# Altium project current amplifier.PrjPCB
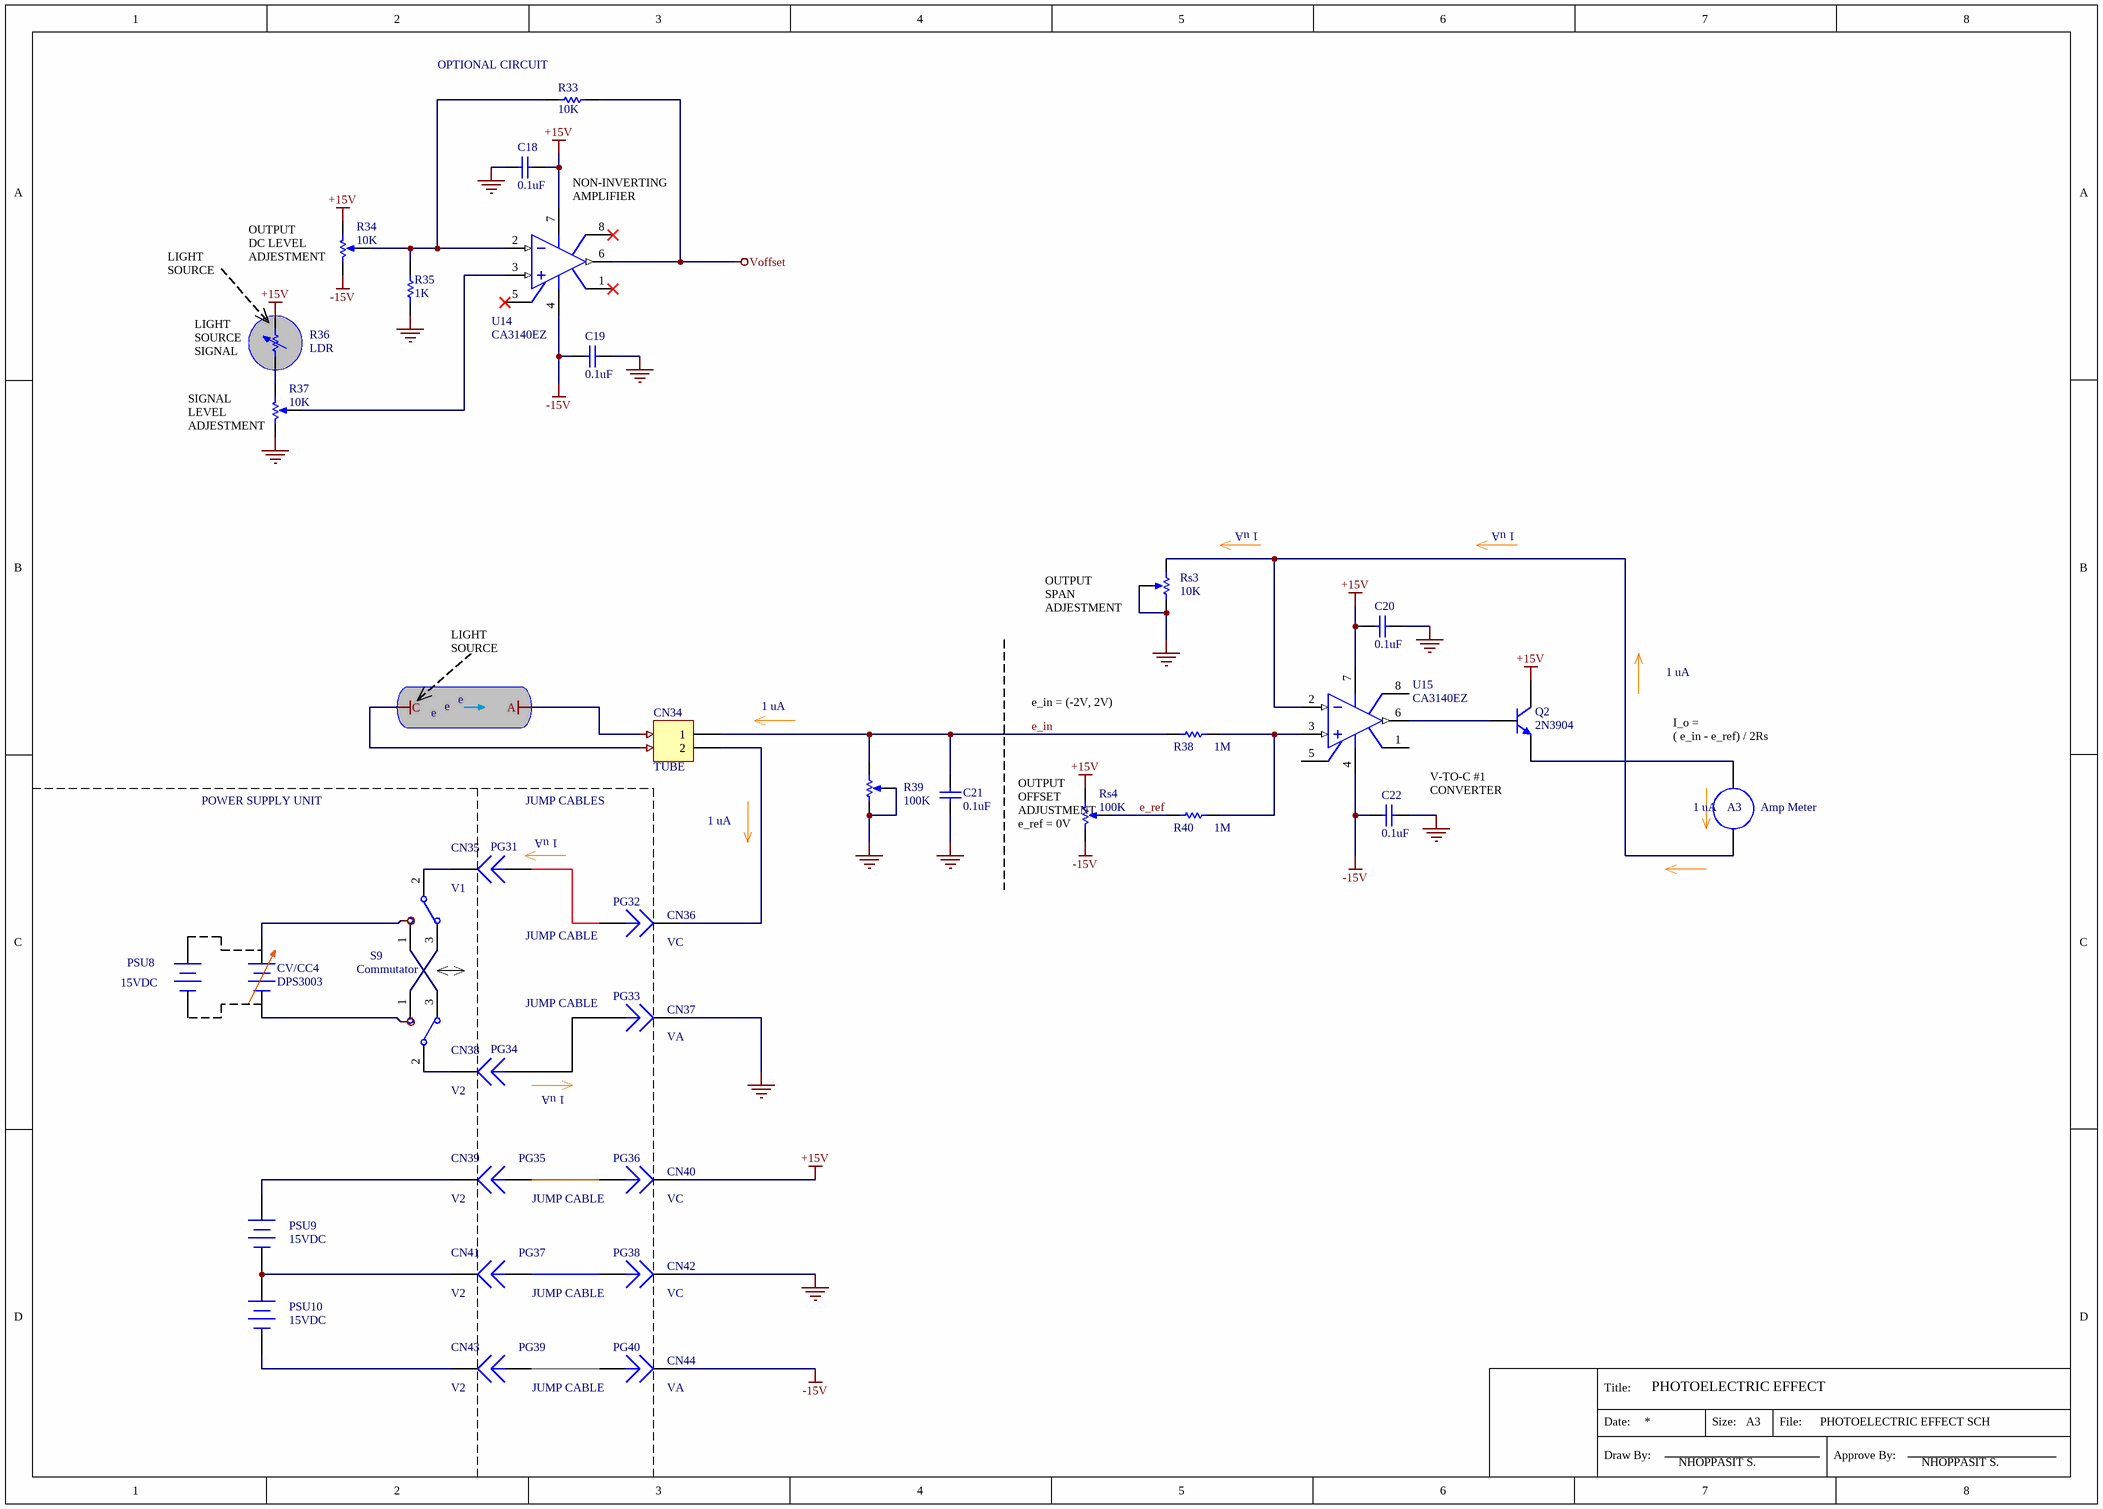
[diagram p0: current amplifier 06.SchDoc]
4 sheets, 211 parts. Net scope: global (net labels, ports and power ports of the same name join across sheets).
Sheets:
  current amplifier 06.SchDoc
  current amplifier 04.SchDoc
  current amplifier 05.SchDoc
  current amplifier 07.SchDoc

## Sheet current amplifier 06.SchDoc: PHOTOELECTRIC EFFECT
size A3; ApprovedBy: NHOPPASIT S.; CheckedBy: NHOPPASIT S.; Author: NHOPPASIT S.; DrawnBy: NHOPPASIT S.; DocumentNumber: EE-01; Revision: 1; SheetNumber: 1; SheetTotal: 1; Size: A3; PageSetup: Record=PageOptions|CenterHorizontal=True|CenterVertical=True|PrintScale=0.73|XCorrection=1.00|YCorrection=1.00|PrintKind=0|BorderSize=5000000|LeftOffset=0|BottomOffset=0|Orientation=2|PaperLength=1000|PaperWidth=1000|Scale=100|PaperSource=7|PrintQuality=-3|MediaType=1|DitherType=10|PrintScaleMode=1|PaperKind=A4|PaperIndex=9; DocumentName: PHOTOELECTRIC EFFECT SCH; ProjectName: PHOTOELECTRIC EFFECT 01

### Parts
(Parts that share a designator on the sheet are numbered #1, #2 ... from top to bottom, then left to right.)
A3  Amp Meter  [RAD-0.1]
C18  0.1uF  [RAD-0.3]
C19  0.1uF  [RAD-0.3]
C20  0.1uF  [RAD-0.3]
C21  0.1uF  [RAD-0.3]
C22  0.1uF  [RAD-0.3]
CN34  TUBE  [HDR1X2]
CN35  V1  [PIN1]
CN36  VC  [PIN1]
CN37  VA  [PIN1]
CN38  V2  [PIN1]
CN39  V2  [PIN1]
CN40  VC  [PIN1]
CN41  V2  [PIN1]
CN42  VC  [PIN1]
CN43  V2  [PIN1]
CN44  VA  [PIN1]
CV/CC4  DPS3003  [BAT-2]
PG31  Plug  [PIN1]  (value not drawn)
PG32  Plug  [PIN1]  (value not drawn)
PG33  Plug  [PIN1]  (value not drawn)
PG34  Plug  [PIN1]  (value not drawn)
PG35  Plug  [PIN1]  (value not drawn)
PG36  Plug  [PIN1]  (value not drawn)
PG37  Plug  [PIN1]  (value not drawn)
PG38  Plug  [PIN1]  (value not drawn)
PG39  Plug  [PIN1]  (value not drawn)
PG40  Plug  [PIN1]  (value not drawn)
PSU8  15VDC  [BAT-2]
PSU9  15VDC  [BAT-2]
PSU10  15VDC  [BAT-2]
Q2  2N3904  [TO-92A]
R33  10K  [AXIAL-0.3]
R34  10K  [VR5]
R35  1K  [AXIAL-0.3]
R36  LDR  [AXIAL-0.7]
R37  10K  [VR5]
R38  1M  [AXIAL-0.3]
R39  100K  [VR5]
R40  1M  [AXIAL-0.3]
Rs3#1  10K  [VR5]
Rs4  100K  [VR5]
S9  Commutator  [TL36WW15050]
S10  SW-SPDT  [TL36WW15050]  (value not drawn)
U14  CA3140EZ  [H-08A]
U15  CA3140EZ  [H-08A]

### Nets
+15V: C18.2 C20.1 CN40.1 Q2.3(C) R34.1(TOP) R36.2 Rs4.1(TOP) U14.7(V+) U15.7(V+)
-15V: C19.1 C22.1 CN44.1 R34.2(BOT) Rs4.2(BOT) U14.4(V-) U15.4(V-)
A: CV/CC4.1(+) CV/CC4.2(-)  [also labelled C, VCC]
GND: C18.1 C19.2 C20.2 C21.1 C22.2 CN37.1 CN42.1 R35.1 R37.2(BOT) R39.1(TOP) R39.3(TAP) Rs3#1.2(BOT) Rs3#1.3(TAP)
Voffset: R33.2 U14.6(OUT)
e_in: C21.2 CN34.1 R38.1 R39.2(BOT)
e_ref: R40.1 Rs4.3(TAP)
NetA3_1: A3.1 Rs3#1.1(TOP) U15.2(IN-)
NetA3_2: A3.2 Q2.1(E)
NetCN34_2: CN34.2 CN36.1
NetCN35_1: CN35.1 S9.2
NetCN38_1: CN38.1 S10.2
NetCN39_1: CN39.1 PSU9.1(+)
NetCN41_1: CN41.1 PSU9.2(-) PSU10.1(+)
NetCN43_1: CN43.1 PSU10.2(-)
NetPG31_1: PG31.1 PG32.1
NetPG33_1: PG33.1 PG34.1
NetPG35_1: PG35.1 PG36.1
NetPG37_1: PG37.1 PG38.1
NetPG39_1: PG39.1 PG40.1
NetQ2_2: Q2.2(B) U15.6(OUT)
NetR33_1: R33.1 R34.3(TAP) R35.2 U14.2(IN-)
NetR36_1: R36.1 R37.1(TOP)
NetR37_3: R37.3(TAP) U14.3(IN+)
NetR38_2: R38.2 R40.2 U15.3(IN+)
NetS9_1: S9.1 S10.3
NetS9_3: S9.3 S10.1

Not connected (* = marked no-connect by the designer): PSU8 1(+) 2(-); U14 1(OS_NUL)* 5(OS_NUL)* 8(TAB)*; U15 1(OS_NUL) 5(OS_NUL) 8(TAB)

### Notes on the sheet
- (near R33) OPTIONAL CIRCUIT
- NON-INVERTING
  AMPLIFIER
- LIGHT SOURCE
- (near R34) OUTPUT
  DC LEVEL
  ADJESTMENT
- (near R36) LIGHT SOURCE
  SIGNAL
- (near R37) SIGNAL
  LEVEL
  ADJESTMENT
- 1 uA
- (near Rs3#1) OUTPUT
  SPAN
  ADJESTMENT
- e
- e_in = (-2V, 2V)
- (near A3) I_o =
  ( e_in - e_ref) / 2Rs
- POWER SUPPLY UNIT
- JUMP CABLES
- (near PG31) 1 uA
- (near Rs4) OUTPUT
  OFFSET
  ADJUSTMENT
  e_ref = 0V
- V-TO-C #1
  CONVERTER
- (near A3) 1 uA
- JUMP CABLE
- (near PG34) 1 uA
- Title:
- Date:
- Draw By:
- Size:
- File:
- Approve By:

### Library data of the parts
A3 = Meter: Indicating Instrument; Note: Place a "letter" into the symbol to show the function of the meter or instrument; Published: 24-Mar-1999; LatestRevisionDate: 17-Jul-2002; LatestRevisionNote: Re-released for DXP Platform.; PackageReference: RAD-0.1; Publisher: Altium Limited; PackageDescription: Radial Cap, Thru-Hole; 2 Leads; 0.1 in Pin Spacing
C18-C22 = Cap: Capacitor; Published: 8-Jun-2000; LatestRevisionDate: 17-Jul-2002; LatestRevisionNote: Re-released for DXP Platform.; PackageReference: RAD-0.3; Publisher: Altium Limited; PackageDescription: Radial Cap, Thru-Hole; 2 Leads; 0.3 in Pin Spacing; Value: 0.1uF
CN34 = Header 2: Header, 2-Pin; LatestRevisionDate: 17-Jul-2002; LatestRevisionNote: Re-released for DXP Platform.; Publisher: Altium Limited
CN35-CN44 = Socket: LatestRevisionDate: 17-Jul-2002; LatestRevisionNote: Re-released for DXP Platform.; Publisher: Altium Limited
CV/CC4 PSU8-PSU10 = Battery: Multicell Battery; Published: 24-Mar-1999; LatestRevisionDate: 17-Jul-2002; LatestRevisionNote: Re-released for DXP Platform.; PackageReference: BAT-2; Publisher: Altium Limited; PackageDescription: Battery; 2 Leads
Q2 = 2N3904: NPN General Purpose Amplifier; Published: 8-Jun-2000; LatestRevisionDate: 15-Jan-2003; LatestRevisionNote: PCB Footprint 'BCY-W3/D4.7' replaced; DatasheetVersion: 1997; PackageVersion: Sep-1998; PackageReference: TO-92A; Publisher: Altium Limited; PackageDescription: TO, Flat Index; 3 In-Line, Axial Leads; Body Dia. 4.5mm; Leads 0.51 x 0.48 mm (max); ComponentLink1Description: Manufacturer Link; ComponentLink1URL: http://www.fairchildsemi.com/; ComponentLink2Description: Datasheet; ComponentLink2URL: http://www.fairchildsemi.com/ds/2N%2F2N3904.pdf
R33 R35 R38 R40 = Res1: Resistor; Published: 8-Jun-2000; LatestRevisionDate: 17-Jul-2002; LatestRevisionNote: Re-released for DXP Platform.; PackageReference: AXIAL-0.3; Publisher: Altium Limited; PackageDescription: Axial Device, Thru-Hole; 2 Leads; 0.3 in Pin Spacing
  R33: Value: 10K
  R35: Value: 1K
  R38 R40: Value: 1M
R34 R37 R39 Rs3#1 Rs4 = RPot: Potentiometer; Sim Note: Enter the Resistance value and the set point into parameter fields.; Set Position: 0.5; Published: 8-Jun-2000; LatestRevisionDate: 17-Jul-2002; LatestRevisionNote: Re-released for DXP Platform.; PackageReference: VR5; Publisher: Altium Limited; PackageDescription: Variable Resistor, Thru-Hole; 3 Leads
  R34 R37 Rs3#1: Value: 10K
  R39 Rs4: Value: 100K
R36 = Res Adj1: Variable Resistor; Value: 1K; Set Position: 0.5; Published: 8-Jun-2000; LatestRevisionDate: 17-Jul-2002; LatestRevisionNote: Re-released for DXP Platform.; PackageReference: AXIAL-0.7; Publisher: Altium Limited; PackageDescription: Axial Device, Thru-Hole; 2 Leads; 0.7 in Pin Spacing
S9 S10 = SW-SPDT: SPDT Subminiature Toggle Switch, Right Angle Mounting, Vertical Actuation; Published: 24-Mar-1999; LatestRevisionDate: 17-Dec-2003; LatestRevisionNote: Schematic revised, PCB Footprint replaced.; DatasheetVersion: 05-Dec-2000; PackageReference: TL36WW15050; Publisher: Altium Limited; PackageDescription: Switch; 4 Leads; ComponentLink1Description: Manufacturer Link; ComponentLink1URL: http://www.apem.com
U14 U15 = Op Amp: FET Operational Amplifier; Published: 8-Jun-2000; LatestRevisionDate: 17-Jul-2002; LatestRevisionNote: Re-released for DXP Platform.; DatasheetVersion: REV. B; PackageVersion: 1990; PackageReference: H-08A; Publisher: Altium Limited; PackageDescription: Can; 8 Leads; Pin Circle Dia. 5.08 mm; Lead Dia. 0.53 mm (max); ComponentLink1Description: Manufacturer Link; ComponentLink1URL: http://www.analog.com/
PG31-PG40 = Plug: LatestRevisionDate: 17-Jul-2002; LatestRevisionNote: Re-released for DXP Platform.; Publisher: Altium Limited

## Sheet current amplifier 04.SchDoc: PHOTOELECTRIC EFFECT
size A3; ApprovedBy: NHOPPASIT S.; CheckedBy: NHOPPASIT S.; Author: NHOPPASIT S.; DrawnBy: NHOPPASIT S.; DocumentNumber: EE-01; Revision: 1; SheetNumber: 1; SheetTotal: 1; Size: A3; PageSetup: Record=PageOptions|CenterHorizontal=True|CenterVertical=True|PrintScale=0.73|XCorrection=1.00|YCorrection=1.00|PrintKind=0|BorderSize=5000000|LeftOffset=0|BottomOffset=0|Orientation=2|PaperLength=1000|PaperWidth=1000|Scale=100|PaperSource=7|PrintQuality=-3|MediaType=1|DitherType=10|PrintScaleMode=1|PaperKind=A4|PaperIndex=9; DocumentName: PHOTOELECTRIC EFFECT SCH; ProjectName: PHOTOELECTRIC EFFECT 01
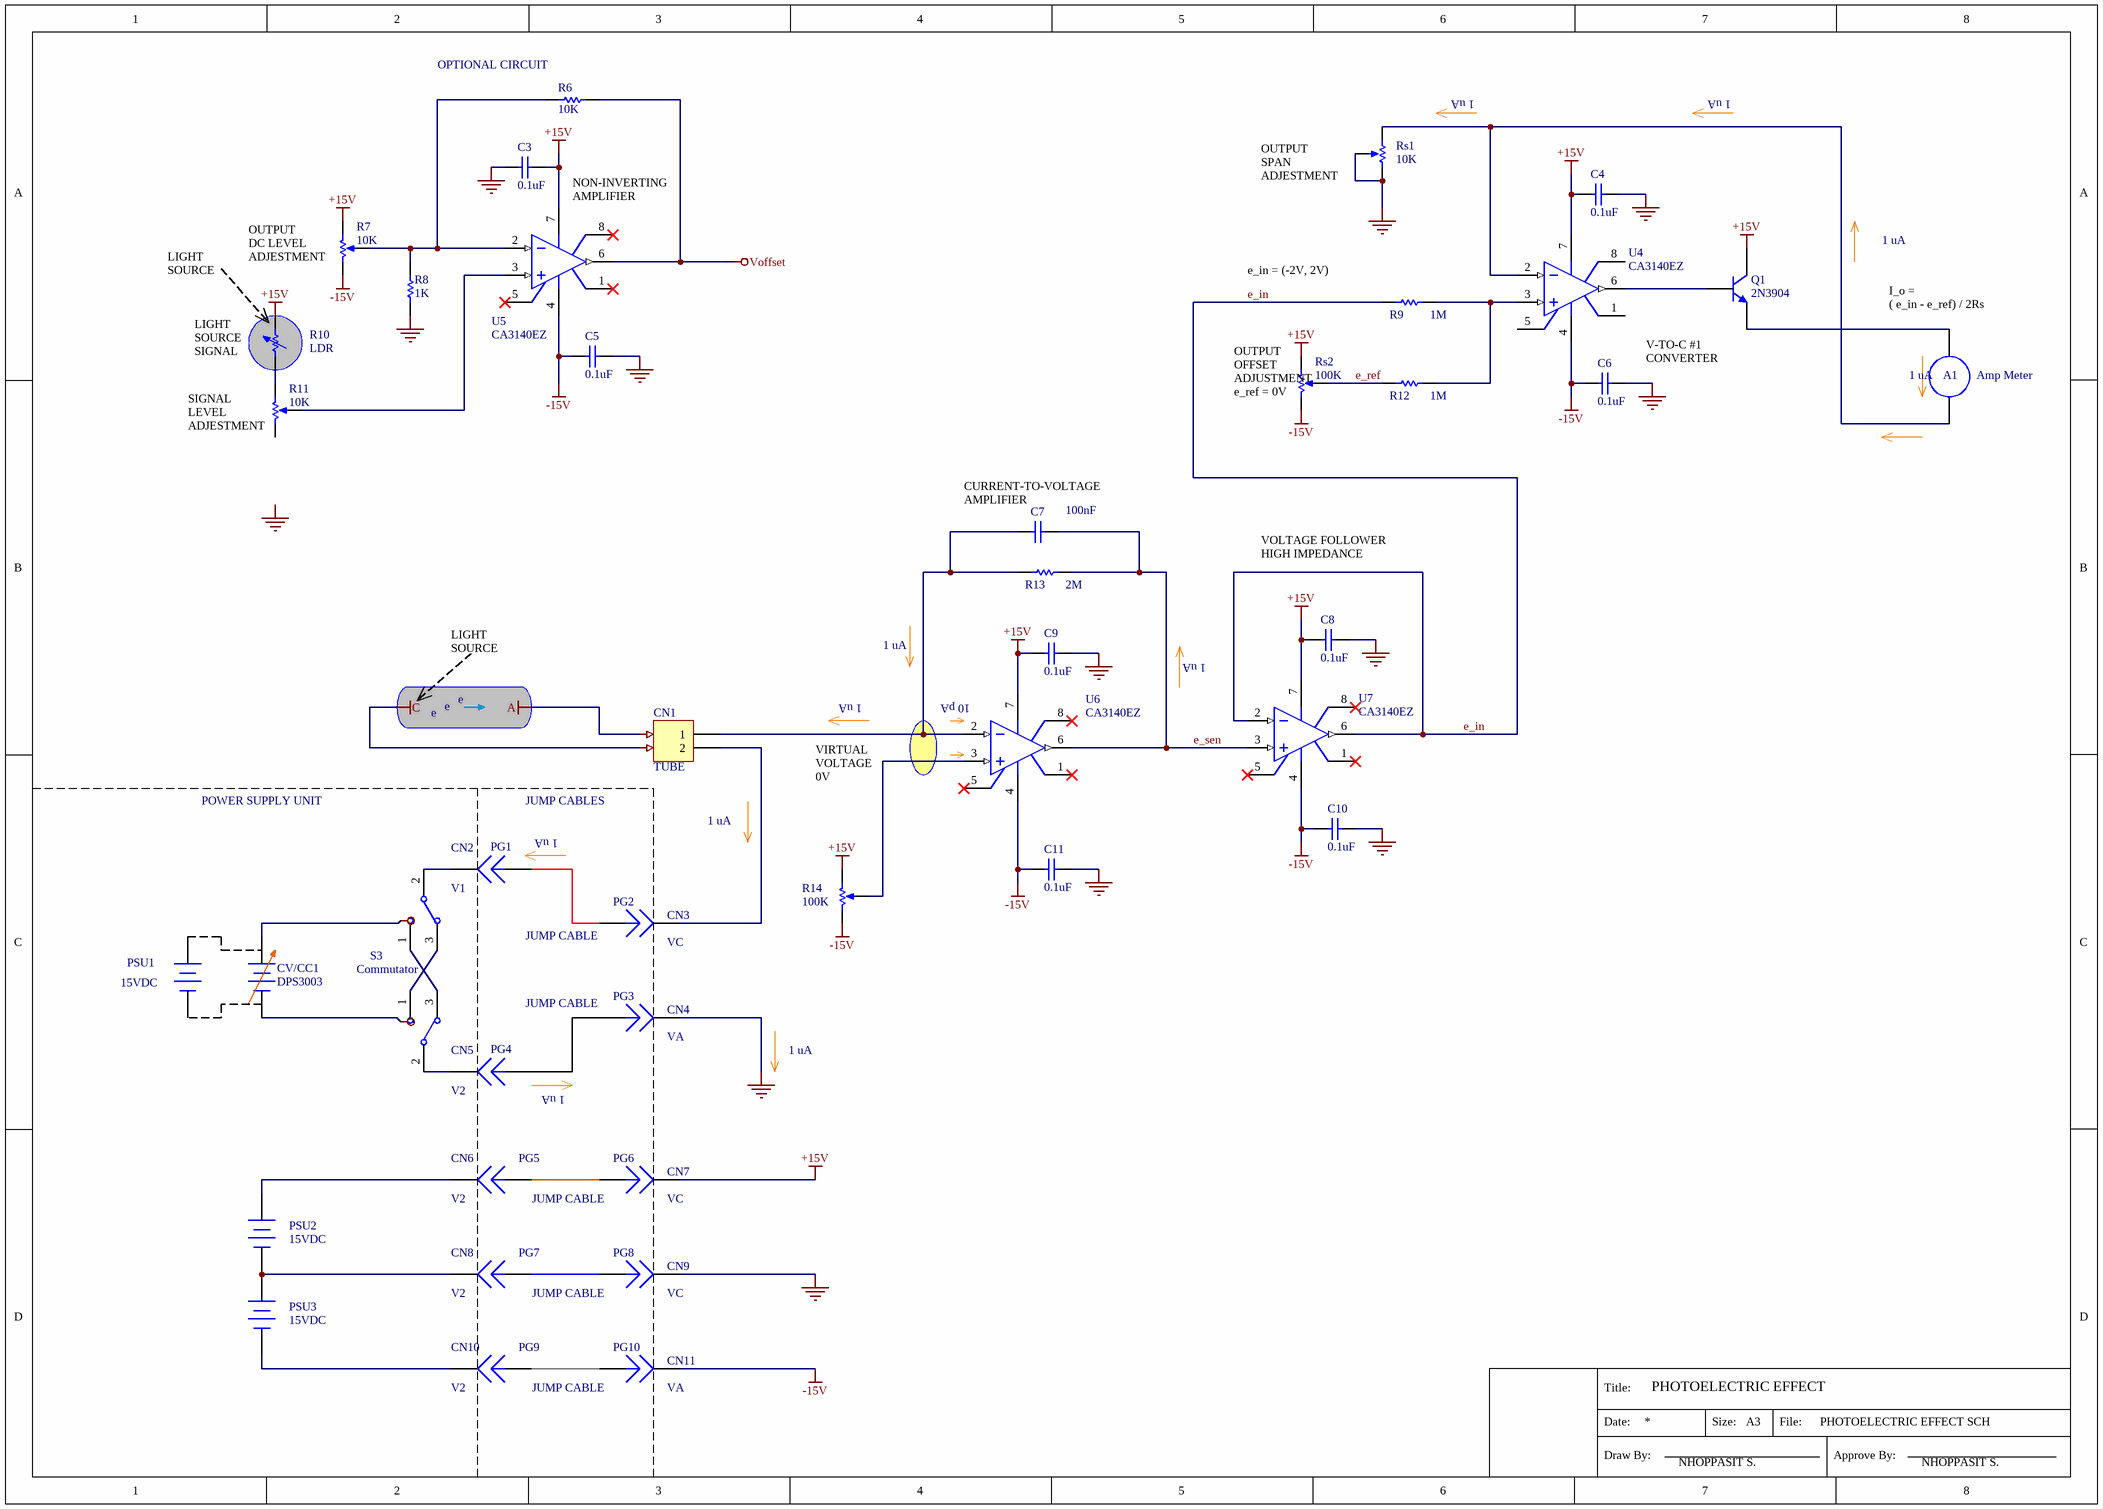
[diagram p1: current amplifier 04.SchDoc]

### Parts
(Parts that share a designator on the sheet are numbered #1, #2 ... from top to bottom, then left to right.)
A1#1  Amp Meter  [RAD-0.1]
C3#1  0.1uF  [RAD-0.3]
C4#1  0.1uF  [RAD-0.3]
C5#1  0.1uF  [RAD-0.3]
C6#1  0.1uF  [RAD-0.3]
C7#1  100nF  [RAD-0.3]
C8#1  0.1uF  [RAD-0.3]
C9#1  0.1uF  [RAD-0.3]
C10#1  0.1uF  [RAD-0.3]
C11#1  0.1uF  [RAD-0.3]
CN1#1  TUBE  [HDR1X2]
CN2#1  V1  [PIN1]
CN3#1  VC  [PIN1]
CN4#1  VA  [PIN1]
CN5#1  V2  [PIN1]
CN6#1  V2  [PIN1]
CN7#1  VC  [PIN1]
CN8#1  V2  [PIN1]
CN9#1  VC  [PIN1]
CN10#1  V2  [PIN1]
CN11#1  VA  [PIN1]
CV/CC1#1  DPS3003  [BAT-2]
PG1#1  Plug  [PIN1]  (value not drawn)
PG2#1  Plug  [PIN1]  (value not drawn)
PG3#1  Plug  [PIN1]  (value not drawn)
PG4#1  Plug  [PIN1]  (value not drawn)
PG5#1  Plug  [PIN1]  (value not drawn)
PG6#1  Plug  [PIN1]  (value not drawn)
PG7#1  Plug  [PIN1]  (value not drawn)
PG8#1  Plug  [PIN1]  (value not drawn)
PG9#1  Plug  [PIN1]  (value not drawn)
PG10#1  Plug  [PIN1]  (value not drawn)
PSU1#1  15VDC  [BAT-2]
PSU2#1  15VDC  [BAT-2]
PSU3#1  15VDC  [BAT-2]
Q1#1  2N3904  [TO-92A]
R6#1  10K  [AXIAL-0.3]
R7#1  10K  [VR5]
R8#1  1K  [AXIAL-0.3]
R9#1  1M  [AXIAL-0.3]
R10#1  LDR  [AXIAL-0.7]
R11#1  10K  [VR5]
R12#1  1M  [AXIAL-0.3]
R13#1  2M  [AXIAL-0.3]
R14#1  100K  [VR5]
Rs1#1  10K  [VR5]
Rs2#1  100K  [VR5]
S3#1  Commutator  [TL36WW15050]
S4#1  SW-SPDT  [TL36WW15050]  (value not drawn)
U4#1  CA3140EZ  [H-08A]
U5#1  CA3140EZ  [H-08A]
U6#1  CA3140EZ  [H-08A]
U7#1  CA3140EZ  [H-08A]

### Nets
+15V: C3#1.2 C4#1.1 C8#1.1 C9#1.1 CN7#1.1 Q1#1.3(C) R7#1.1(TOP) R10#1.2 R14#1.1(TOP) Rs2#1.1(TOP) U4#1.7(V+) U5#1.7(V+) U6#1.7(V+) U7#1.7(V+)
-15V: C5#1.1 C6#1.1 C10#1.1 C11#1.1 CN11#1.1 R7#1.2(BOT) R14#1.2(BOT) Rs2#1.2(BOT) U4#1.4(V-) U5#1.4(V-) U6#1.4(V-) U7#1.4(V-)
A: CV/CC1#1.1(+) CV/CC1#1.2(-)  [also labelled C, VCC]
GND: C3#1.1 C4#1.2 C5#1.2 C6#1.2 C8#1.2 C9#1.2 C10#1.2 C11#1.2 CN4#1.1 CN9#1.1 R8#1.1 Rs1#1.2(BOT) Rs1#1.3(TAP)
Voffset: R6#1.2 U5#1.6(OUT)
e_in: R9#1.1 U7#1.2(IN-) U7#1.6(OUT)
e_ref: R12#1.1 Rs2#1.3(TAP)
e_sen: C7#1.2 R13#1.2 U6#1.6(OUT) U7#1.3(IN+)
NetA1#1_1: A1#1.1 Rs1#1.1(TOP) U4#1.2(IN-)
NetA1#1_2: A1#1.2 Q1#1.1(E)
NetC7#1_1: C7#1.1 CN1#1.1 R13#1.1 U6#1.2(IN-)
NetCN1#1_2: CN1#1.2 CN3#1.1
NetCN2#1_1: CN2#1.1 S3#1.2
NetCN5#1_1: CN5#1.1 S4#1.2
NetCN6#1_1: CN6#1.1 PSU2#1.1(+)
NetCN8#1_1: CN8#1.1 PSU2#1.2(-) PSU3#1.1(+)
NetCN10#1_1: CN10#1.1 PSU3#1.2(-)
NetPG1#1_1: PG1#1.1 PG2#1.1
NetPG3#1_1: PG3#1.1 PG4#1.1
NetPG5#1_1: PG5#1.1 PG6#1.1
NetPG7#1_1: PG7#1.1 PG8#1.1
NetPG9#1_1: PG9#1.1 PG10#1.1
NetQ1#1_2: Q1#1.2(B) U4#1.6(OUT)
NetR6#1_1: R6#1.1 R7#1.3(TAP) R8#1.2 U5#1.2(IN-)
NetR9#1_2: R9#1.2 R12#1.2 U4#1.3(IN+)
NetR10#1_1: R10#1.1 R11#1.1(TOP)
NetR11#1_3: R11#1.3(TAP) U5#1.3(IN+)
NetR14#1_3: R14#1.3(TAP) U6#1.3(IN+)
NetS3#1_1: S3#1.1 S4#1.3
NetS3#1_3: S3#1.3 S4#1.1

Not connected (* = marked no-connect by the designer): PSU1#1 1(+) 2(-); R11#1 2(BOT); U4#1 1(OS_NUL) 5(OS_NUL) 8(TAB); U5#1 1(OS_NUL)* 5(OS_NUL)* 8(TAB)*; U6#1 1(OS_NUL)* 5(OS_NUL)* 8(TAB)*; U7#1 1(OS_NUL)* 5(OS_NUL)* 8(TAB)*

### Notes on the sheet
- (near R6#1) OPTIONAL CIRCUIT
- 1 uA
- (near Rs1#1) OUTPUT
  SPAN
  ADJESTMENT
- NON-INVERTING
  AMPLIFIER
- LIGHT SOURCE
- (near R7#1) OUTPUT
  DC LEVEL
  ADJESTMENT
- e_in = (-2V, 2V)
- (near A1#1) I_o =
  ( e_in - e_ref) / 2Rs
- (near R10#1) LIGHT SOURCE
  SIGNAL
- V-TO-C #1
  CONVERTER
- (near A1#1) 1 uA
- (near R11#1) SIGNAL
  LEVEL
  ADJESTMENT
- (near Rs2#1) OUTPUT
  OFFSET
  ADJUSTMENT
  e_ref = 0V
- (near C7#1) CURRENT-TO-VOLTAGE
  AMPLIFIER
- VOLTAGE FOLLOWER
  HIGH IMPEDANCE
- e
- (near U6#1) 10 pA
- VIRTUAL
  VOLTAGE
  0V
- POWER SUPPLY UNIT
- JUMP CABLES
- (near PG1#1) 1 uA
- JUMP CABLE
- (near PG4#1) 1 uA
- Labels drawn without touching a wire or pin: GND
- Title:
- Date:
- Draw By:
- Size:
- File:
- Approve By:

### Library data of the parts
A1#1 = Meter: as A3 on sheet current amplifier 06; Published: 24-Mar-1999; LatestRevisionDate: 17-Jul-2002; LatestRevisionNote: Re-released for DXP Platform.; PackageReference: RAD-0.1; Publisher: Altium Limited; PackageDescription: Radial Cap, Thru-Hole; 2 Leads; 0.1 in Pin Spacing
C3#1 C4#1 C5#1 C6#1 C7#1 C8#1 C9#1 C10#1 C11#1 = Cap: Capacitor; Published: 8-Jun-2000; LatestRevisionDate: 17-Jul-2002; LatestRevisionNote: Re-released for DXP Platform.; PackageReference: RAD-0.3; Publisher: Altium Limited; PackageDescription: Radial Cap, Thru-Hole; 2 Leads; 0.3 in Pin Spacing
  C3#1 C4#1 C5#1 C6#1 C8#1 C9#1 C10#1 C11#1: Value: 0.1uF
  C7#1: Value: 100nF
CN1#1 = Header 2: Header, 2-Pin; LatestRevisionDate: 17-Jul-2002; LatestRevisionNote: Re-released for DXP Platform.; Publisher: Altium Limited
CN2#1 CN3#1 CN4#1 CN5#1 CN6#1 CN7#1 CN8#1 CN9#1 CN10#1 CN11#1 = Socket: LatestRevisionDate: 17-Jul-2002; LatestRevisionNote: Re-released for DXP Platform.; Publisher: Altium Limited
CV/CC1#1 PSU1#1 PSU2#1 PSU3#1 = Battery: Multicell Battery; Published: 24-Mar-1999; LatestRevisionDate: 17-Jul-2002; LatestRevisionNote: Re-released for DXP Platform.; PackageReference: BAT-2; Publisher: Altium Limited; PackageDescription: Battery; 2 Leads
Q1#1 = 2N3904: NPN General Purpose Amplifier; Published: 8-Jun-2000; LatestRevisionDate: 15-Jan-2003; LatestRevisionNote: PCB Footprint 'BCY-W3/D4.7' replaced; DatasheetVersion: 1997; PackageVersion: Sep-1998; PackageReference: TO-92A; Publisher: Altium Limited; PackageDescription: TO, Flat Index; 3 In-Line, Axial Leads; Body Dia. 4.5mm; Leads 0.51 x 0.48 mm (max); ComponentLink1Description: Manufacturer Link; ComponentLink1URL: http://www.fairchildsemi.com/; ComponentLink2Description: Datasheet; ComponentLink2URL: http://www.fairchildsemi.com/ds/2N%2F2N3904.pdf
R6#1 R8#1 R9#1 R12#1 R13#1 = Res1: Resistor; Published: 8-Jun-2000; LatestRevisionDate: 17-Jul-2002; LatestRevisionNote: Re-released for DXP Platform.; PackageReference: AXIAL-0.3; Publisher: Altium Limited; PackageDescription: Axial Device, Thru-Hole; 2 Leads; 0.3 in Pin Spacing
  R6#1: Value: 10K
  R8#1: Value: 1K
  R9#1 R12#1: Value: 1M
  R13#1: Value: 2M
R7#1 R11#1 R14#1 Rs1#1 Rs2#1 = RPot: as R34 on sheet current amplifier 06; Published: 8-Jun-2000; LatestRevisionDate: 17-Jul-2002; LatestRevisionNote: Re-released for DXP Platform.; PackageReference: VR5; Publisher: Altium Limited; PackageDescription: Variable Resistor, Thru-Hole; 3 Leads
  R7#1 R11#1 Rs1#1: Value: 10K
  R14#1 Rs2#1: Value: 100K
R10#1 = Res Adj1: as R36 on sheet current amplifier 06; Published: 8-Jun-2000; LatestRevisionDate: 17-Jul-2002; LatestRevisionNote: Re-released for DXP Platform.; PackageReference: AXIAL-0.7; Publisher: Altium Limited; PackageDescription: Axial Device, Thru-Hole; 2 Leads; 0.7 in Pin Spacing
S3#1 S4#1 = SW-SPDT: as S9 on sheet current amplifier 06; Published: 24-Mar-1999; LatestRevisionDate: 17-Dec-2003; LatestRevisionNote: Schematic revised, PCB Footprint replaced.; DatasheetVersion: 05-Dec-2000; PackageReference: TL36WW15050; Publisher: Altium Limited; PackageDescription: Switch; 4 Leads; ComponentLink1Description: Manufacturer Link; ComponentLink1URL: http://www.apem.com
U4#1 U5#1 U6#1 U7#1 = Op Amp: FET Operational Amplifier; Published: 8-Jun-2000; LatestRevisionDate: 17-Jul-2002; LatestRevisionNote: Re-released for DXP Platform.; DatasheetVersion: REV. B; PackageVersion: 1990; PackageReference: H-08A; Publisher: Altium Limited; PackageDescription: Can; 8 Leads; Pin Circle Dia. 5.08 mm; Lead Dia. 0.53 mm (max); ComponentLink1Description: Manufacturer Link; ComponentLink1URL: http://www.analog.com/
PG1#1 PG2#1 PG3#1 PG4#1 PG5#1 PG6#1 PG7#1 PG8#1 PG9#1 PG10#1 = Plug: LatestRevisionDate: 17-Jul-2002; LatestRevisionNote: Re-released for DXP Platform.; Publisher: Altium Limited

## Sheet current amplifier 05.SchDoc: PHOTOELECTRIC EFFECT
size A3; ApprovedBy: NHOPPASIT S.; CheckedBy: NHOPPASIT S.; Author: NHOPPASIT S.; DrawnBy: NHOPPASIT S.; DocumentNumber: EE-01; Revision: 1; SheetNumber: 1; SheetTotal: 1; Size: A3; PageSetup: Record=PageOptions|CenterHorizontal=True|CenterVertical=True|PrintScale=0.73|XCorrection=1.00|YCorrection=1.00|PrintKind=0|BorderSize=5000000|LeftOffset=0|BottomOffset=0|Orientation=2|PaperLength=1000|PaperWidth=1000|Scale=100|PaperSource=7|PrintQuality=-3|MediaType=1|DitherType=10|PrintScaleMode=1|PaperKind=A4|PaperIndex=9; DocumentName: PHOTOELECTRIC EFFECT SCH; ProjectName: PHOTOELECTRIC EFFECT 01
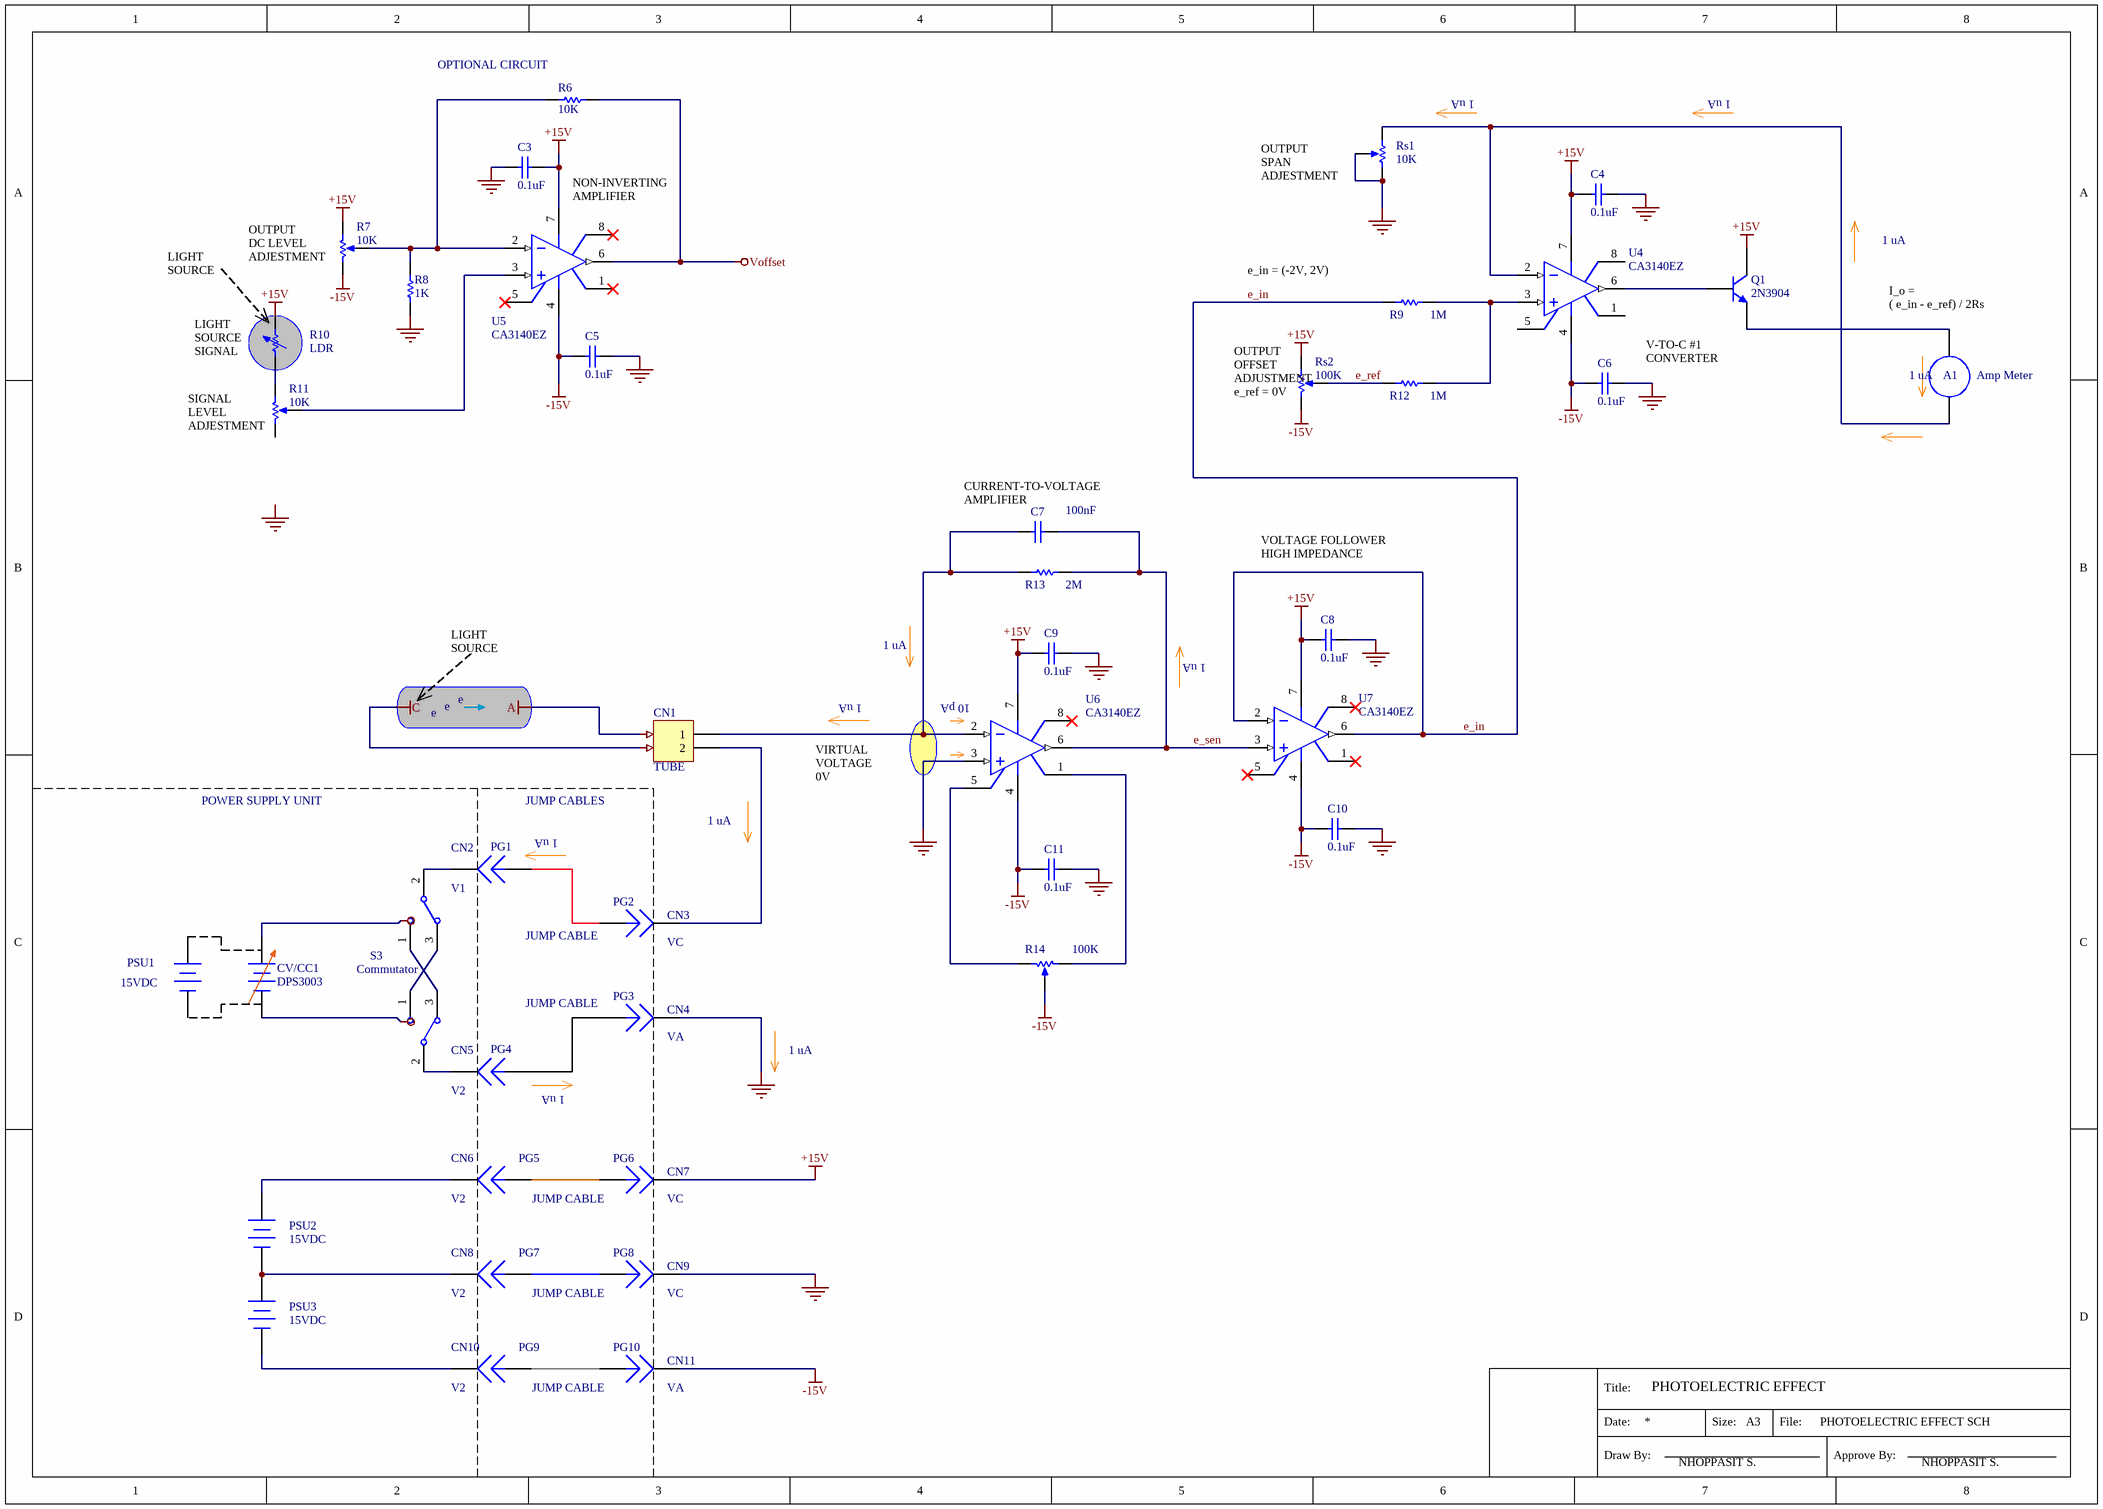
[diagram p2: current amplifier 05.SchDoc]

### Parts
(Parts that share a designator on the sheet are numbered #1, #2 ... from top to bottom, then left to right.)
A1#2  Amp Meter  [RAD-0.1]
C3#2  0.1uF  [RAD-0.3]
C4#2  0.1uF  [RAD-0.3]
C5#2  0.1uF  [RAD-0.3]
C6#2  0.1uF  [RAD-0.3]
C7#2  100nF  [RAD-0.3]
C8#2  0.1uF  [RAD-0.3]
C9#2  0.1uF  [RAD-0.3]
C10#2  0.1uF  [RAD-0.3]
C11#2  0.1uF  [RAD-0.3]
CN1#2  TUBE  [HDR1X2]
CN2#2  V1  [PIN1]
CN3#2  VC  [PIN1]
CN4#2  VA  [PIN1]
CN5#2  V2  [PIN1]
CN6#2  V2  [PIN1]
CN7#2  VC  [PIN1]
CN8#2  V2  [PIN1]
CN9#2  VC  [PIN1]
CN10#2  V2  [PIN1]
CN11#2  VA  [PIN1]
CV/CC1#2  DPS3003  [BAT-2]
PG1#2  Plug  [PIN1]  (value not drawn)
PG2#2  Plug  [PIN1]  (value not drawn)
PG3#2  Plug  [PIN1]  (value not drawn)
PG4#2  Plug  [PIN1]  (value not drawn)
PG5#2  Plug  [PIN1]  (value not drawn)
PG6#2  Plug  [PIN1]  (value not drawn)
PG7#2  Plug  [PIN1]  (value not drawn)
PG8#2  Plug  [PIN1]  (value not drawn)
PG9#2  Plug  [PIN1]  (value not drawn)
PG10#2  Plug  [PIN1]  (value not drawn)
PSU1#2  15VDC  [BAT-2]
PSU2#2  15VDC  [BAT-2]
PSU3#2  15VDC  [BAT-2]
Q1#2  2N3904  [TO-92A]
R6#2  10K  [AXIAL-0.3]
R7#2  10K  [VR5]
R8#2  1K  [AXIAL-0.3]
R9#2  1M  [AXIAL-0.3]
R10#2  LDR  [AXIAL-0.7]
R11#2  10K  [VR5]
R12#2  1M  [AXIAL-0.3]
R13#2  2M  [AXIAL-0.3]
R14#2  100K  [VR5]
Rs1#2  10K  [VR5]
Rs2#2  100K  [VR5]
S3#2  Commutator  [TL36WW15050]
S4#2  SW-SPDT  [TL36WW15050]  (value not drawn)
U4#2  CA3140EZ  [H-08A]
U5#2  CA3140EZ  [H-08A]
U6#2  CA3140EZ  [H-08A]
U7#2  CA3140EZ  [H-08A]

### Nets
+15V: C3#2.2 C4#2.1 C8#2.1 C9#2.1 CN7#2.1 Q1#2.3(C) R7#2.1(TOP) R10#2.2 Rs2#2.1(TOP) U4#2.7(V+) U5#2.7(V+) U6#2.7(V+) U7#2.7(V+)
-15V: C5#2.1 C6#2.1 C10#2.1 C11#2.1 CN11#2.1 R7#2.2(BOT) R14#2.3(TAP) Rs2#2.2(BOT) U4#2.4(V-) U5#2.4(V-) U6#2.4(V-) U7#2.4(V-)
A: CV/CC1#2.1(+) CV/CC1#2.2(-)  [also labelled C, VCC]
GND: C3#2.1 C4#2.2 C5#2.2 C6#2.2 C8#2.2 C9#2.2 C10#2.2 C11#2.2 CN4#2.1 CN9#2.1 R8#2.1 Rs1#2.2(BOT) Rs1#2.3(TAP) U6#2.3(IN+)
Voffset: R6#2.2 U5#2.6(OUT)
e_in: R9#2.1 U7#2.2(IN-) U7#2.6(OUT)
e_ref: R12#2.1 Rs2#2.3(TAP)
e_sen: C7#2.2 R13#2.2 U6#2.6(OUT) U7#2.3(IN+)
NetA1#2_1: A1#2.1 Rs1#2.1(TOP) U4#2.2(IN-)
NetA1#2_2: A1#2.2 Q1#2.1(E)
NetC7#2_1: C7#2.1 CN1#2.1 R13#2.1 U6#2.2(IN-)
NetCN1#2_2: CN1#2.2 CN3#2.1
NetCN2#2_1: CN2#2.1 S3#2.2
NetCN5#2_1: CN5#2.1 S4#2.2
NetCN6#2_1: CN6#2.1 PSU2#2.1(+)
NetCN8#2_1: CN8#2.1 PSU2#2.2(-) PSU3#2.1(+)
NetCN10#2_1: CN10#2.1 PSU3#2.2(-)
NetPG1#2_1: PG1#2.1 PG2#2.1
NetPG3#2_1: PG3#2.1 PG4#2.1
NetPG5#2_1: PG5#2.1 PG6#2.1
NetPG7#2_1: PG7#2.1 PG8#2.1
NetPG9#2_1: PG9#2.1 PG10#2.1
NetQ1#2_2: Q1#2.2(B) U4#2.6(OUT)
NetR6#2_1: R6#2.1 R7#2.3(TAP) R8#2.2 U5#2.2(IN-)
NetR9#2_2: R9#2.2 R12#2.2 U4#2.3(IN+)
NetR10#2_1: R10#2.1 R11#2.1(TOP)
NetR11#2_3: R11#2.3(TAP) U5#2.3(IN+)
NetR14#2_1: R14#2.1(TOP) U6#2.1(OS_NUL)
NetR14#2_2: R14#2.2(BOT) U6#2.5(OS_NUL)
NetS3#2_1: S3#2.1 S4#2.3
NetS3#2_3: S3#2.3 S4#2.1

Not connected (* = marked no-connect by the designer): PSU1#2 1(+) 2(-); R11#2 2(BOT); U4#2 1(OS_NUL) 5(OS_NUL) 8(TAB); U5#2 1(OS_NUL)* 5(OS_NUL)* 8(TAB)*; U6#2 8(TAB)*; U7#2 1(OS_NUL)* 5(OS_NUL)* 8(TAB)*

### Notes on the sheet
- (near R6#2) OPTIONAL CIRCUIT
- 1 uA
- (near Rs1#2) OUTPUT
  SPAN
  ADJESTMENT
- NON-INVERTING
  AMPLIFIER
- LIGHT SOURCE
- (near R7#2) OUTPUT
  DC LEVEL
  ADJESTMENT
- e_in = (-2V, 2V)
- (near A1#2) I_o =
  ( e_in - e_ref) / 2Rs
- (near R10#2) LIGHT SOURCE
  SIGNAL
- V-TO-C #1
  CONVERTER
- (near A1#2) 1 uA
- (near R11#2) SIGNAL
  LEVEL
  ADJESTMENT
- (near Rs2#2) OUTPUT
  OFFSET
  ADJUSTMENT
  e_ref = 0V
- (near C7#2) CURRENT-TO-VOLTAGE
  AMPLIFIER
- VOLTAGE FOLLOWER
  HIGH IMPEDANCE
- e
- (near U6#2) 10 pA
- VIRTUAL
  VOLTAGE
  0V
- POWER SUPPLY UNIT
- JUMP CABLES
- (near PG1#2) 1 uA
- JUMP CABLE
- (near PG4#2) 1 uA
- Labels drawn without touching a wire or pin: GND
- Title:
- Date:
- Draw By:
- Size:
- File:
- Approve By:

### Library data of the parts
A1#2 = Meter: as A3 on sheet current amplifier 06; Published: 24-Mar-1999; LatestRevisionDate: 17-Jul-2002; LatestRevisionNote: Re-released for DXP Platform.; PackageReference: RAD-0.1; Publisher: Altium Limited; PackageDescription: Radial Cap, Thru-Hole; 2 Leads; 0.1 in Pin Spacing
C3#2 C4#2 C5#2 C6#2 C7#2 C8#2 C9#2 C10#2 C11#2 = Cap: Capacitor; Published: 8-Jun-2000; LatestRevisionDate: 17-Jul-2002; LatestRevisionNote: Re-released for DXP Platform.; PackageReference: RAD-0.3; Publisher: Altium Limited; PackageDescription: Radial Cap, Thru-Hole; 2 Leads; 0.3 in Pin Spacing
  C3#2 C4#2 C5#2 C6#2 C8#2 C9#2 C10#2 C11#2: Value: 0.1uF
  C7#2: Value: 100nF
CN1#2 = Header 2: Header, 2-Pin; LatestRevisionDate: 17-Jul-2002; LatestRevisionNote: Re-released for DXP Platform.; Publisher: Altium Limited
CN2#2 CN3#2 CN4#2 CN5#2 CN6#2 CN7#2 CN8#2 CN9#2 CN10#2 CN11#2 = Socket: LatestRevisionDate: 17-Jul-2002; LatestRevisionNote: Re-released for DXP Platform.; Publisher: Altium Limited
CV/CC1#2 PSU1#2 PSU2#2 PSU3#2 = Battery: Multicell Battery; Published: 24-Mar-1999; LatestRevisionDate: 17-Jul-2002; LatestRevisionNote: Re-released for DXP Platform.; PackageReference: BAT-2; Publisher: Altium Limited; PackageDescription: Battery; 2 Leads
Q1#2 = 2N3904: NPN General Purpose Amplifier; Published: 8-Jun-2000; LatestRevisionDate: 15-Jan-2003; LatestRevisionNote: PCB Footprint 'BCY-W3/D4.7' replaced; DatasheetVersion: 1997; PackageVersion: Sep-1998; PackageReference: TO-92A; Publisher: Altium Limited; PackageDescription: TO, Flat Index; 3 In-Line, Axial Leads; Body Dia. 4.5mm; Leads 0.51 x 0.48 mm (max); ComponentLink1Description: Manufacturer Link; ComponentLink1URL: http://www.fairchildsemi.com/; ComponentLink2Description: Datasheet; ComponentLink2URL: http://www.fairchildsemi.com/ds/2N%2F2N3904.pdf
R6#2 R8#2 R9#2 R12#2 R13#2 = Res1: Resistor; Published: 8-Jun-2000; LatestRevisionDate: 17-Jul-2002; LatestRevisionNote: Re-released for DXP Platform.; PackageReference: AXIAL-0.3; Publisher: Altium Limited; PackageDescription: Axial Device, Thru-Hole; 2 Leads; 0.3 in Pin Spacing
  R6#2: Value: 10K
  R8#2: Value: 1K
  R9#2 R12#2: Value: 1M
  R13#2: Value: 2M
R7#2 R11#2 R14#2 Rs1#2 Rs2#2 = RPot: as R34 on sheet current amplifier 06; Published: 8-Jun-2000; LatestRevisionDate: 17-Jul-2002; LatestRevisionNote: Re-released for DXP Platform.; PackageReference: VR5; Publisher: Altium Limited; PackageDescription: Variable Resistor, Thru-Hole; 3 Leads
  R7#2 R11#2 Rs1#2: Value: 10K
  R14#2 Rs2#2: Value: 100K
R10#2 = Res Adj1: as R36 on sheet current amplifier 06; Published: 8-Jun-2000; LatestRevisionDate: 17-Jul-2002; LatestRevisionNote: Re-released for DXP Platform.; PackageReference: AXIAL-0.7; Publisher: Altium Limited; PackageDescription: Axial Device, Thru-Hole; 2 Leads; 0.7 in Pin Spacing
S3#2 S4#2 = SW-SPDT: as S9 on sheet current amplifier 06; Published: 24-Mar-1999; LatestRevisionDate: 17-Dec-2003; LatestRevisionNote: Schematic revised, PCB Footprint replaced.; DatasheetVersion: 05-Dec-2000; PackageReference: TL36WW15050; Publisher: Altium Limited; PackageDescription: Switch; 4 Leads; ComponentLink1Description: Manufacturer Link; ComponentLink1URL: http://www.apem.com
U4#2 U5#2 U6#2 U7#2 = Op Amp: FET Operational Amplifier; Published: 8-Jun-2000; LatestRevisionDate: 17-Jul-2002; LatestRevisionNote: Re-released for DXP Platform.; DatasheetVersion: REV. B; PackageVersion: 1990; PackageReference: H-08A; Publisher: Altium Limited; PackageDescription: Can; 8 Leads; Pin Circle Dia. 5.08 mm; Lead Dia. 0.53 mm (max); ComponentLink1Description: Manufacturer Link; ComponentLink1URL: http://www.analog.com/
PG1#2 PG2#2 PG3#2 PG4#2 PG5#2 PG6#2 PG7#2 PG8#2 PG9#2 PG10#2 = Plug: LatestRevisionDate: 17-Jul-2002; LatestRevisionNote: Re-released for DXP Platform.; Publisher: Altium Limited

## Sheet current amplifier 07.SchDoc: PHOTOELECTRIC EFFECT
size A3; ApprovedBy: NHOPPASIT S.; CheckedBy: NHOPPASIT S.; Author: NHOPPASIT S.; DrawnBy: NHOPPASIT S.; DocumentNumber: EE-01; Revision: 1; SheetNumber: 1; SheetTotal: 1; Size: A3; PageSetup: Record=PageOptions|CenterHorizontal=True|CenterVertical=True|PrintScale=0.73|XCorrection=1.00|YCorrection=1.00|PrintKind=0|BorderSize=5000000|LeftOffset=0|BottomOffset=0|Orientation=2|PaperLength=1000|PaperWidth=1000|Scale=100|PaperSource=7|PrintQuality=-3|MediaType=1|DitherType=10|PrintScaleMode=1|PaperKind=A4|PaperIndex=9; DocumentName: PHOTOELECTRIC EFFECT SCH; ProjectName: PHOTOELECTRIC EFFECT 01
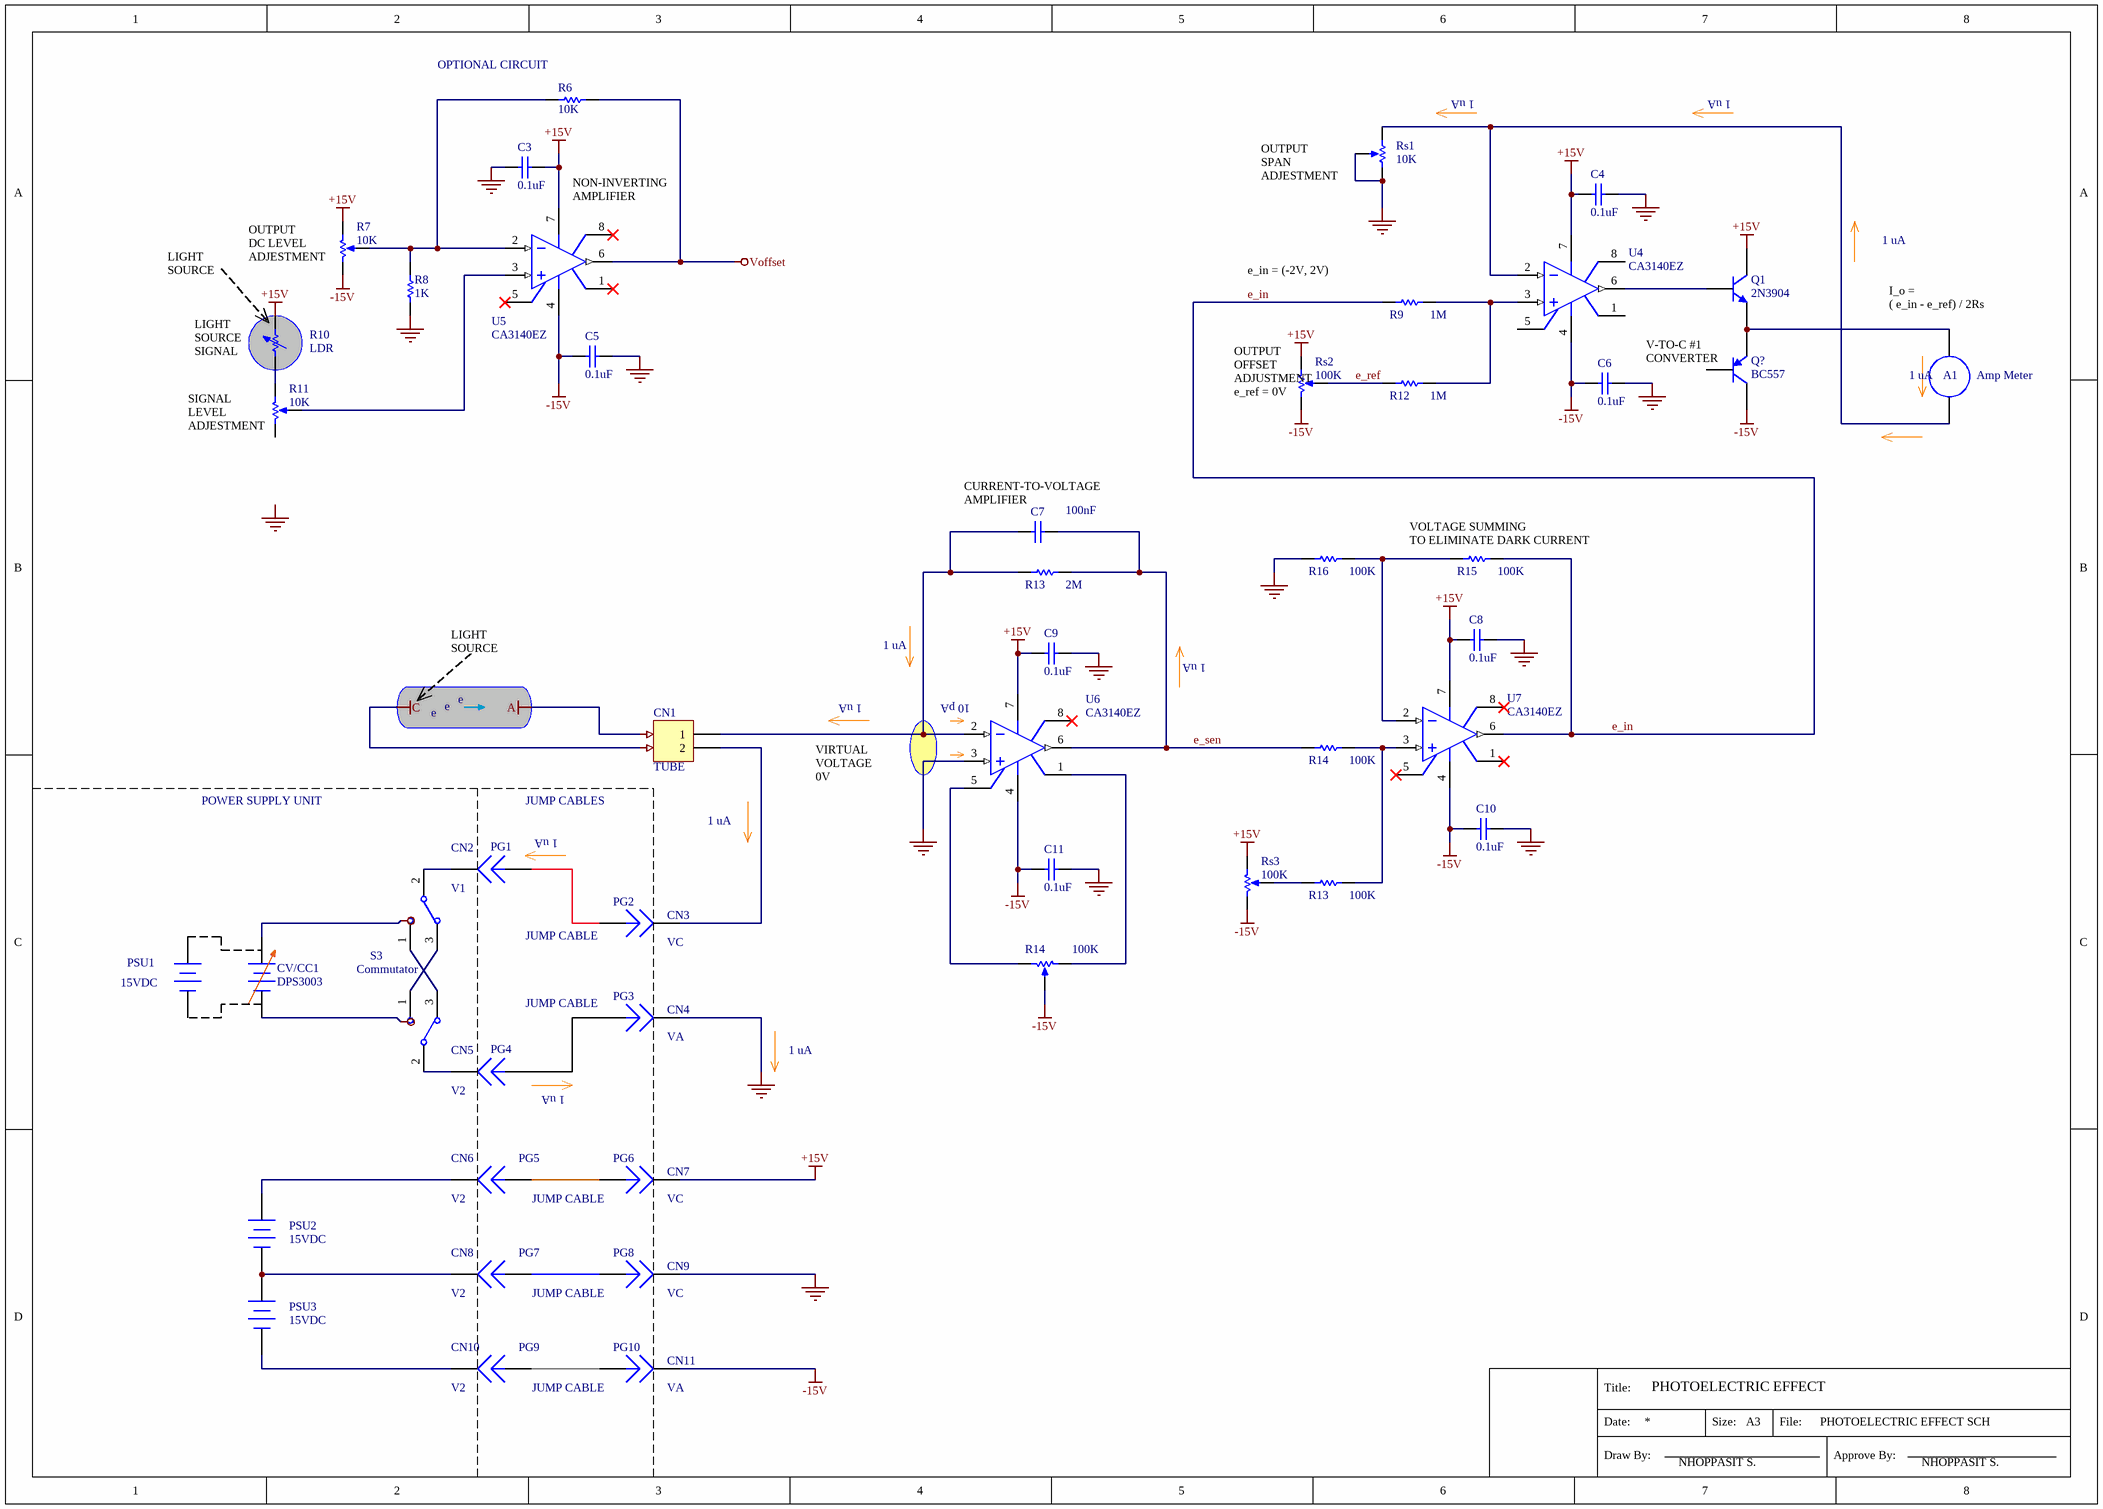
[diagram p3: current amplifier 07.SchDoc]

### Parts
(Parts that share a designator on the sheet are numbered #1, #2 ... from top to bottom, then left to right.)
A1#3  Amp Meter  [RAD-0.1]
C3#3  0.1uF  [RAD-0.3]
C4#3  0.1uF  [RAD-0.3]
C5#3  0.1uF  [RAD-0.3]
C6#3  0.1uF  [RAD-0.3]
C7#3  100nF  [RAD-0.3]
C8#3  0.1uF  [RAD-0.3]
C9#3  0.1uF  [RAD-0.3]
C10#3  0.1uF  [RAD-0.3]
C11#3  0.1uF  [RAD-0.3]
CN1#3  TUBE  [HDR1X2]
CN2#3  V1  [PIN1]
CN3#3  VC  [PIN1]
CN4#3  VA  [PIN1]
CN5#3  V2  [PIN1]
CN6#3  V2  [PIN1]
CN7#3  VC  [PIN1]
CN8#3  V2  [PIN1]
CN9#3  VC  [PIN1]
CN10#3  V2  [PIN1]
CN11#3  VA  [PIN1]
CV/CC1#3  DPS3003  [BAT-2]
PG1#3  Plug  [PIN1]  (value not drawn)
PG2#3  Plug  [PIN1]  (value not drawn)
PG3#3  Plug  [PIN1]  (value not drawn)
PG4#3  Plug  [PIN1]  (value not drawn)
PG5#3  Plug  [PIN1]  (value not drawn)
PG6#3  Plug  [PIN1]  (value not drawn)
PG7#3  Plug  [PIN1]  (value not drawn)
PG8#3  Plug  [PIN1]  (value not drawn)
PG9#3  Plug  [PIN1]  (value not drawn)
PG10#3  Plug  [PIN1]  (value not drawn)
PSU1#3  15VDC  [BAT-2]
PSU2#3  15VDC  [BAT-2]
PSU3#3  15VDC  [BAT-2]
Q1#3  2N3904  [TO-92A]
Q?  BC557  [29-04]
R6#3  10K  [AXIAL-0.3]
R7#3  10K  [VR5]
R8#3  1K  [AXIAL-0.3]
R9#3  1M  [AXIAL-0.3]
R10#3  LDR  [AXIAL-0.7]
R11#3  10K  [VR5]
R12#3  1M  [AXIAL-0.3]
R13#3  2M  [AXIAL-0.3]
R13#4  100K  [AXIAL-0.3]
R14#3  100K  [AXIAL-0.3]
R14#4  100K  [VR5]
R15  100K  [AXIAL-0.3]
R16  100K  [AXIAL-0.3]
Rs1#3  10K  [VR5]
Rs2#3  100K  [VR5]
Rs3#2  100K  [VR5]
S3#3  Commutator  [TL36WW15050]
S4#3  SW-SPDT  [TL36WW15050]  (value not drawn)
U4#3  CA3140EZ  [H-08A]
U5#3  CA3140EZ  [H-08A]
U6#3  CA3140EZ  [H-08A]
U7#3  CA3140EZ  [H-08A]

### Nets
+15V: C3#3.2 C4#3.1 C8#3.1 C9#3.1 CN7#3.1 Q1#3.3(C) R7#3.1(TOP) R10#3.2 Rs2#3.1(TOP) Rs3#2.1(TOP) U4#3.7(V+) U5#3.7(V+) U6#3.7(V+) U7#3.7(V+)
-15V: C5#3.1 C6#3.1 C10#3.1 C11#3.1 CN11#3.1 Q?.1(C) R7#3.2(BOT) R14#4.3(TAP) Rs2#3.2(BOT) Rs3#2.2(BOT) U4#3.4(V-) U5#3.4(V-) U6#3.4(V-) U7#3.4(V-)
A: CV/CC1#3.1(+) CV/CC1#3.2(-)  [also labelled C, VCC]
GND: C3#3.1 C4#3.2 C5#3.2 C6#3.2 C8#3.2 C9#3.2 C10#3.2 C11#3.2 CN4#3.1 CN9#3.1 R8#3.1 R16.1 Rs1#3.2(BOT) Rs1#3.3(TAP) U6#3.3(IN+)
Voffset: R6#3.2 U5#3.6(OUT)
e_in: R9#3.1 R15.2 U7#3.6(OUT)
e_ref: R12#3.1 Rs2#3.3(TAP)
e_sen: C7#3.2 R13#3.2 R14#3.1 U6#3.6(OUT)
NetA1#3_1: A1#3.1 Rs1#3.1(TOP) U4#3.2(IN-)
NetA1#3_2: A1#3.2 Q1#3.1(E) Q?.3(E)
NetC7#3_1: C7#3.1 CN1#3.1 R13#3.1 U6#3.2(IN-)
NetCN1#3_2: CN1#3.2 CN3#3.1
NetCN2#3_1: CN2#3.1 S3#3.2
NetCN5#3_1: CN5#3.1 S4#3.2
NetCN6#3_1: CN6#3.1 PSU2#3.1(+)
NetCN8#3_1: CN8#3.1 PSU2#3.2(-) PSU3#3.1(+)
NetCN10#3_1: CN10#3.1 PSU3#3.2(-)
NetPG1#3_1: PG1#3.1 PG2#3.1
NetPG3#3_1: PG3#3.1 PG4#3.1
NetPG5#3_1: PG5#3.1 PG6#3.1
NetPG7#3_1: PG7#3.1 PG8#3.1
NetPG9#3_1: PG9#3.1 PG10#3.1
NetQ1#3_2: Q1#3.2(B) U4#3.6(OUT)
NetR6#3_1: R6#3.1 R7#3.3(TAP) R8#3.2 U5#3.2(IN-)
NetR9#3_2: R9#3.2 R12#3.2 U4#3.3(IN+)
NetR10#3_1: R10#3.1 R11#3.1(TOP)
NetR11#3_3: R11#3.3(TAP) U5#3.3(IN+)
NetR13#4_1: R13#4.1 Rs3#2.3(TAP)
NetR13#4_2: R13#4.2 R14#3.2 U7#3.3(IN+)
NetR14#4_1: R14#4.1(TOP) U6#3.1(OS_NUL)
NetR14#4_2: R14#4.2(BOT) U6#3.5(OS_NUL)
NetR15_1: R15.1 R16.2 U7#3.2(IN-)
NetS3#3_1: S3#3.1 S4#3.3
NetS3#3_3: S3#3.3 S4#3.1

Not connected (* = marked no-connect by the designer): PSU1#3 1(+) 2(-); Q? 2(B); R11#3 2(BOT); U4#3 1(OS_NUL) 5(OS_NUL) 8(TAB); U5#3 1(OS_NUL)* 5(OS_NUL)* 8(TAB)*; U6#3 8(TAB)*; U7#3 1(OS_NUL)* 5(OS_NUL)* 8(TAB)*

### Notes on the sheet
- (near R6#3) OPTIONAL CIRCUIT
- 1 uA
- (near Rs1#3) OUTPUT
  SPAN
  ADJESTMENT
- NON-INVERTING
  AMPLIFIER
- LIGHT SOURCE
- (near R7#3) OUTPUT
  DC LEVEL
  ADJESTMENT
- e_in = (-2V, 2V)
- (near A1#3) I_o =
  ( e_in - e_ref) / 2Rs
- (near R10#3) LIGHT SOURCE
  SIGNAL
- (near Q?) V-TO-C #1
  CONVERTER
- (near A1#3) 1 uA
- (near R11#3) SIGNAL
  LEVEL
  ADJESTMENT
- (near Rs2#3) OUTPUT
  OFFSET
  ADJUSTMENT
  e_ref = 0V
- (near C7#3) CURRENT-TO-VOLTAGE
  AMPLIFIER
- (near R15) VOLTAGE SUMMING
  TO ELIMINATE DARK CURRENT
- e
- (near U6#3) 10 pA
- VIRTUAL
  VOLTAGE
  0V
- POWER SUPPLY UNIT
- JUMP CABLES
- (near PG1#3) 1 uA
- JUMP CABLE
- (near PG4#3) 1 uA
- Labels drawn without touching a wire or pin: GND
- Title:
- Date:
- Draw By:
- Size:
- File:
- Approve By:

### Library data of the parts
A1#3 = Meter: as A3 on sheet current amplifier 06; Published: 24-Mar-1999; LatestRevisionDate: 17-Jul-2002; LatestRevisionNote: Re-released for DXP Platform.; PackageReference: RAD-0.1; Publisher: Altium Limited; PackageDescription: Radial Cap, Thru-Hole; 2 Leads; 0.1 in Pin Spacing
C3#3 C4#3 C5#3 C6#3 C7#3 C8#3 C9#3 C10#3 C11#3 = Cap: Capacitor; Published: 8-Jun-2000; LatestRevisionDate: 17-Jul-2002; LatestRevisionNote: Re-released for DXP Platform.; PackageReference: RAD-0.3; Publisher: Altium Limited; PackageDescription: Radial Cap, Thru-Hole; 2 Leads; 0.3 in Pin Spacing
  C3#3 C4#3 C5#3 C6#3 C8#3 C9#3 C10#3 C11#3: Value: 0.1uF
  C7#3: Value: 100nF
CN1#3 = Header 2: Header, 2-Pin; LatestRevisionDate: 17-Jul-2002; LatestRevisionNote: Re-released for DXP Platform.; Publisher: Altium Limited
CN2#3 CN3#3 CN4#3 CN5#3 CN6#3 CN7#3 CN8#3 CN9#3 CN10#3 CN11#3 = Socket: LatestRevisionDate: 17-Jul-2002; LatestRevisionNote: Re-released for DXP Platform.; Publisher: Altium Limited
CV/CC1#3 PSU1#3 PSU2#3 PSU3#3 = Battery: Multicell Battery; Published: 24-Mar-1999; LatestRevisionDate: 17-Jul-2002; LatestRevisionNote: Re-released for DXP Platform.; PackageReference: BAT-2; Publisher: Altium Limited; PackageDescription: Battery; 2 Leads
Q1#3 = 2N3904: NPN General Purpose Amplifier; Published: 8-Jun-2000; LatestRevisionDate: 15-Jan-2003; LatestRevisionNote: PCB Footprint 'BCY-W3/D4.7' replaced; DatasheetVersion: 1997; PackageVersion: Sep-1998; PackageReference: TO-92A; Publisher: Altium Limited; PackageDescription: TO, Flat Index; 3 In-Line, Axial Leads; Body Dia. 4.5mm; Leads 0.51 x 0.48 mm (max); ComponentLink1Description: Manufacturer Link; ComponentLink1URL: http://www.fairchildsemi.com/; ComponentLink2Description: Datasheet; ComponentLink2URL: http://www.fairchildsemi.com/ds/2N%2F2N3904.pdf
Q? = BC557: Amplifier Transistor PNP Silicon; Published: 29-Sep-2000; LatestRevisionDate: 17-Jul-2002; LatestRevisionNote: Re-released for DXP Platform.; DatasheetVersion: 1991; PackageVersion: 1996; PackageReference: 29-04; Publisher: Altium Limited; PackageDescription: TO, Flat Index; 3 In-Line, Axial Leads; Body Dia. 4.8mm; Leads 0.48 x 0.5 mm (max); ComponentLink1Description: Manufacturer Link; ComponentLink1URL: http://www.onsemi.com/site/products/landing?taxonomyID=194; ComponentLink2Description: Datasheet; ComponentLink2URL: http://www.onsemi.com/pub/Collateral/BC556B-D.PDF
R6#3 R8#3 R9#3 R12#3 R13#3 R13#4 R14#3 R15 R16 = Res1: Resistor; Published: 8-Jun-2000; LatestRevisionDate: 17-Jul-2002; LatestRevisionNote: Re-released for DXP Platform.; PackageReference: AXIAL-0.3; Publisher: Altium Limited; PackageDescription: Axial Device, Thru-Hole; 2 Leads; 0.3 in Pin Spacing
  R6#3: Value: 10K
  R8#3: Value: 1K
  R9#3 R12#3: Value: 1M
  R13#3: Value: 2M
  R13#4 R14#3 R15 R16: Value: 100K
R7#3 R11#3 R14#4 Rs1#3 Rs2#3 Rs3#2 = RPot: as R34 on sheet current amplifier 06; Published: 8-Jun-2000; LatestRevisionDate: 17-Jul-2002; LatestRevisionNote: Re-released for DXP Platform.; PackageReference: VR5; Publisher: Altium Limited; PackageDescription: Variable Resistor, Thru-Hole; 3 Leads
  R7#3 R11#3 Rs1#3: Value: 10K
  R14#4 Rs2#3 Rs3#2: Value: 100K
R10#3 = Res Adj1: as R36 on sheet current amplifier 06; Published: 8-Jun-2000; LatestRevisionDate: 17-Jul-2002; LatestRevisionNote: Re-released for DXP Platform.; PackageReference: AXIAL-0.7; Publisher: Altium Limited; PackageDescription: Axial Device, Thru-Hole; 2 Leads; 0.7 in Pin Spacing
S3#3 S4#3 = SW-SPDT: as S9 on sheet current amplifier 06; Published: 24-Mar-1999; LatestRevisionDate: 17-Dec-2003; LatestRevisionNote: Schematic revised, PCB Footprint replaced.; DatasheetVersion: 05-Dec-2000; PackageReference: TL36WW15050; Publisher: Altium Limited; PackageDescription: Switch; 4 Leads; ComponentLink1Description: Manufacturer Link; ComponentLink1URL: http://www.apem.com
U4#3 U5#3 U6#3 U7#3 = Op Amp: FET Operational Amplifier; Published: 8-Jun-2000; LatestRevisionDate: 17-Jul-2002; LatestRevisionNote: Re-released for DXP Platform.; DatasheetVersion: REV. B; PackageVersion: 1990; PackageReference: H-08A; Publisher: Altium Limited; PackageDescription: Can; 8 Leads; Pin Circle Dia. 5.08 mm; Lead Dia. 0.53 mm (max); ComponentLink1Description: Manufacturer Link; ComponentLink1URL: http://www.analog.com/
PG1#3 PG2#3 PG3#3 PG4#3 PG5#3 PG6#3 PG7#3 PG8#3 PG9#3 PG10#3 = Plug: LatestRevisionDate: 17-Jul-2002; LatestRevisionNote: Re-released for DXP Platform.; Publisher: Altium Limited

## Nets that join several sheets
+15V: current amplifier 06 (9 pins), current amplifier 04 (14 pins), current amplifier 05 (13 pins), current amplifier 07 (14 pins)
-15V: current amplifier 06 (7 pins), current amplifier 04 (12 pins), current amplifier 05 (12 pins), current amplifier 07 (14 pins)
A: current amplifier 06 (CV/CC4.1 CV/CC4.2), current amplifier 04 (CV/CC1#1.1 CV/CC1#1.2), current amplifier 05 (CV/CC1#2.1 CV/CC1#2.2), current amplifier 07 (CV/CC1#3.1 CV/CC1#3.2)
GND: current amplifier 06 (13 pins), current amplifier 04 (13 pins), current amplifier 05 (14 pins), current amplifier 07 (15 pins)
Voffset: current amplifier 06 (R33.2 U14.6), current amplifier 04 (R6#1.2 U5#1.6), current amplifier 05 (R6#2.2 U5#2.6), current amplifier 07 (R6#3.2 U5#3.6)
e_in: current amplifier 06 (C21.2 CN34.1 R38.1 R39.2), current amplifier 04 (R9#1.1 U7#1.2 U7#1.6), current amplifier 05 (R9#2.1 U7#2.2 U7#2.6), current amplifier 07 (R9#3.1 R15.2 U7#3.6)
e_ref: current amplifier 06 (R40.1 Rs4.3), current amplifier 04 (R12#1.1 Rs2#1.3), current amplifier 05 (R12#2.1 Rs2#2.3), current amplifier 07 (R12#3.1 Rs2#3.3)
e_sen: current amplifier 04 (C7#1.2 R13#1.2 U6#1.6 U7#1.3), current amplifier 05 (C7#2.2 R13#2.2 U6#2.6 U7#2.3), current amplifier 07 (C7#3.2 R13#3.2 R14#3.1 U6#3.6)